# EAGLE design attiny-batt-board-15mm-mk-1 (EAGLE 6.5.0)
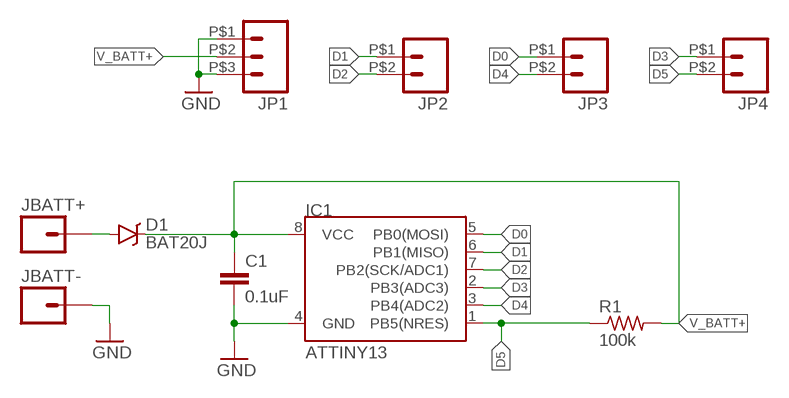
[diagram p0: schematic, sheet 1]

## Parts
C1  0.1uF  CAPACITOR-CERAMICC0603  [C0603]
D1  BAT20J  DIODE-SCHOTTKYBAT20J  [SOD-323]
IC1  ATTINY13  ATTINY13SOIC  [SO08]
JBATT+  M01NOT-A-VIA-NOPE  [1X01_NOSILK_NOSTOP]
JBATT-  M01NOT-A-VIA-NOPE  [1X01_NOSILK_NOSTOP]
JP1  M03PTH-2MM  [1X03-2MM-PTH]
JP2  M02PTH-2MM  [1X02-2MM-PTH]
JP3  M02PTH-2MM  [1X02-2MM-PTH]
JP4  M02PTH-2MM  [1X02-2MM-PTH]
R1  100k  RESISTORR0603  [R0603]

## Nets
BATT_IN: D1.A JBATT+.P$1
D0: IC1.5(PB0(MOSI)) JP3.P$1
D1: IC1.6(PB1(MISO)) JP2.P$1
D2: IC1.7(PB2(SCK/ADC1)) JP2.P$2
D3: IC1.2(PB3(ADC3)) JP4.P$1
D4: IC1.3(PB4(ADC2)) JP3.P$2
D5: IC1.1(PB5(NRES)) JP4.P$2 R1.1
GND: C1.2 IC1.4(GND) JBATT-.P$1 JP1.P$1 JP1.P$3
V_BATT+: C1.1 D1.C IC1.8(VCC) JP1.P$2 R1.2

## Library data of the parts
C1 = A_butts:CAPACITOR-CERAMIC: CAPACITOR, European symbol
D1 = A_butts:DIODE-SCHOTTKY: Schottky diodes in SFE's production catalog BAT20J 1A 23V 0.62Vf RB751 120mA 40V 0.37Vf PMEG4005EJ 0.5A 40V 0.42Vf MBRA140 1A 40V 0.5Vf B340A 3A 40V SMA; PROD_ID: DIO-11623
IC1 = A_butts:ATTINY13: Atmel 8-pin 1kB flash uC
JBATT+ JBATT- = A_butts:M01: Header 1 Standard 1-pin 0.1" header. Use with straight break away headers (SKU : PRT-00116), right angle break away headers (PRT-00553), swiss pins (PRT-00743), machine pins (PRT-00117), and female headers (PRT-00115).
JP1 = A_butts:M03: Header 3 Standard 3-pin 0.1" header. Use with straight break away headers (SKU : PRT-00116), right angle break away headers (PRT-00553), swiss pins (PRT-00743), machine pins (PRT-00117), and female headers (PRT-00115). Molex polarized connector foot print use with SKU : PRT-08232 with associated crimp pins and housings.
JP2-JP4 = A_butts:M02: Standard 2-pin 0.1" header. Use with - straight break away headers ( PRT-00116) - right angle break away headers (PRT-00553) - swiss pins (PRT-00743) - machine pins (PRT-00117) - female headers (PRT-00115) Molex polarized connector foot print use with: PRT-08233 with associated crimp pins and housings. 2.54_SCREWTERM for use with PRT-10571. 3.5mm Screw Terminal footprints for PRT-08084 5mm Screw Terminal footprints for use with PRT-08433
R1 = A_butts:RESISTOR: RESISTOR, American symbol

## Board
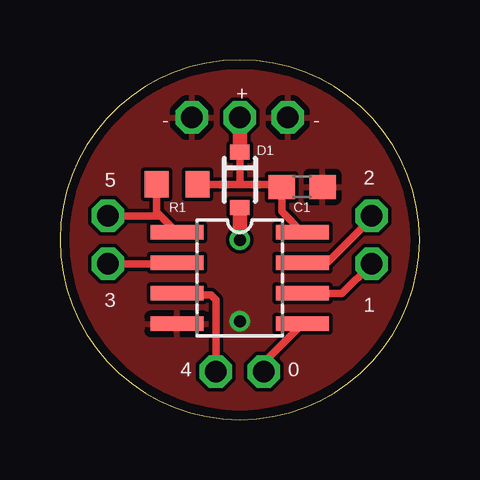
[diagram p1: board, top side]
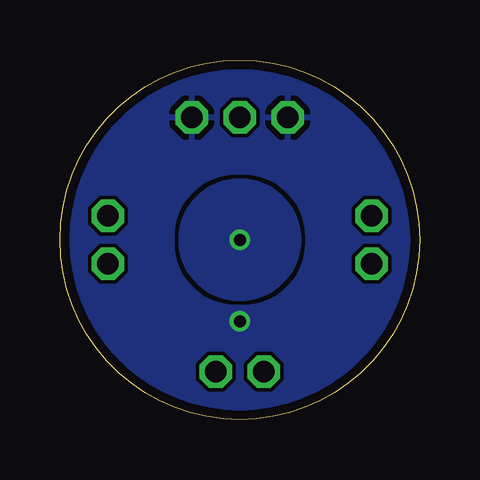
[diagram p2: board, bottom side, seen from below]

Size 15 x 15 mm. Coordinates in mm from the lower left corner, seen from the top.
Outline: 0,7.5 arc90 7.5,0 arc90 15,7.5 arc90 7.5,15 arc90 0,7.5
Copper layers (1*16): Top 0.0356mm / dielectric 1.5011mm / Bottom 0.0356mm
Design rules "LaenPCBOrder2": minimum track width 6mil, minimum drill 13mil, track to track 6mil, track to pad 6mil, pad to pad 6mil, via to via 6mil, smd to smd 6mil, copper to edge 15mil, drill to drill 6mil, minimum pad ring 7mil, minimum via ring 7mil, stop-mask expansion 3mil, vias tented up to drill 20mil, thermal gap 10mil

### Footprints (pad centres in the part's own frame; a part is rotated, then mirrored left to right if it is on the bottom)
C0603 = smd 1.1 x 1: 1 -0.85,0; 2 0.85,0
SOD-323 = smd 0.63 x 0.83: A 1.15,0; C -1.15,0
SO08 = smd 0.61 x 2.21: 1 -1.905,-2.616; 2 -0.635,-2.616; 3 0.635,-2.616; 4 1.905,-2.616; 5 1.905,2.616; 6 0.635,2.616; 7 -0.635,2.616; 8 -1.905,2.616
1X01_NOSILK_NOSTOP = drill 0.5: P$1 0,0
1X03-2MM-PTH = drill 0.9 octagon: P$1 -2,0; P$2 0,0; P$3 2,0
1X02-2MM-PTH = drill 0.9 octagon: P$1 -1,0; P$2 1,0
R0603 = smd 1 x 1.1: 1 -0.85,0; 2 0.85,0

### Placement (x,y rotation side)
C1  10.1,9.7 0 top
D1  7.5,10 270 top
IC1  7.5,5.9 270 top
JBATT+  7.5,7.5 0 top
JBATT-  7.5,4.1 0 top
JP1  7.5,12.6 180 top
JP2  13,7.5 90 top
JP3  7.5,2 180 top
JP4  2,7.5 90 top
R1  4.89,9.81 0 top

### Tracks (layer width: path | path; a pad name or v marks a point on that pad's centre or on a via)
BATT_IN
  Top 0.61: JBATT+.P$1 D1.A
  pour Bottom: 7.5,5 arc-90 5,7.5 arc-90 7.5,10 arc-90 10,7.5 arc-90
D0
  Top 0.305: JP3.P$1 8.5,2.38 IC1.5
D1
  Top 0.305: IC1.6 11.77,5.26 JP2.P$1
D2
  Top 0.305: JP2.P$2 13,8.4 11.1,6.5 10.15,6.5 IC1.7
D3
  Top 0.305: JP4.P$1 4.85,6.5 IC1.2
D4
  Top 0.305: JP3.P$2 6.5,5 6.3,5.2 4.95,5.2 IC1.3
D5
  Top 0.305: JP4.P$2 4.19,8.5 | 4.19,8.5 IC1.1 | R1.1 4.04,8.65 4.19,8.5
GND
  pour Top (rank 6): 7.5,0 arc-90 0,7.5 arc-90 7.5,15 arc-90 15,7.5 arc-90
  pour Bottom (rank 6): 7.5,0 arc-90 0,7.5 arc-90 7.5,15 arc-90 15,7.5 arc-90
V_BATT+
  Top 0.305: 7.5,9.81 9.14,9.81 C1.1 9.25,8.67 IC1.8 | 7.5,9.81 R1.2 | D1.C 7.5,9.81
  Top 0.61: D1.C JP1.P$2

### Text on the board
tNames: + | - | - | 5 | 2 | 3 | 1 | 4 | 0